# Altium schematic sheet 08_USB_hub.SchDoc: USB 2.0 hub
size A3; Organization: Lime Microsystems; Address1: Surrey Tech Centre; Address2: Guildford GU2 7YG; Address3: Surrey; Address4: United Kingdom; Revision: v1.2; SheetNumber: 8; SheetTotal: 13
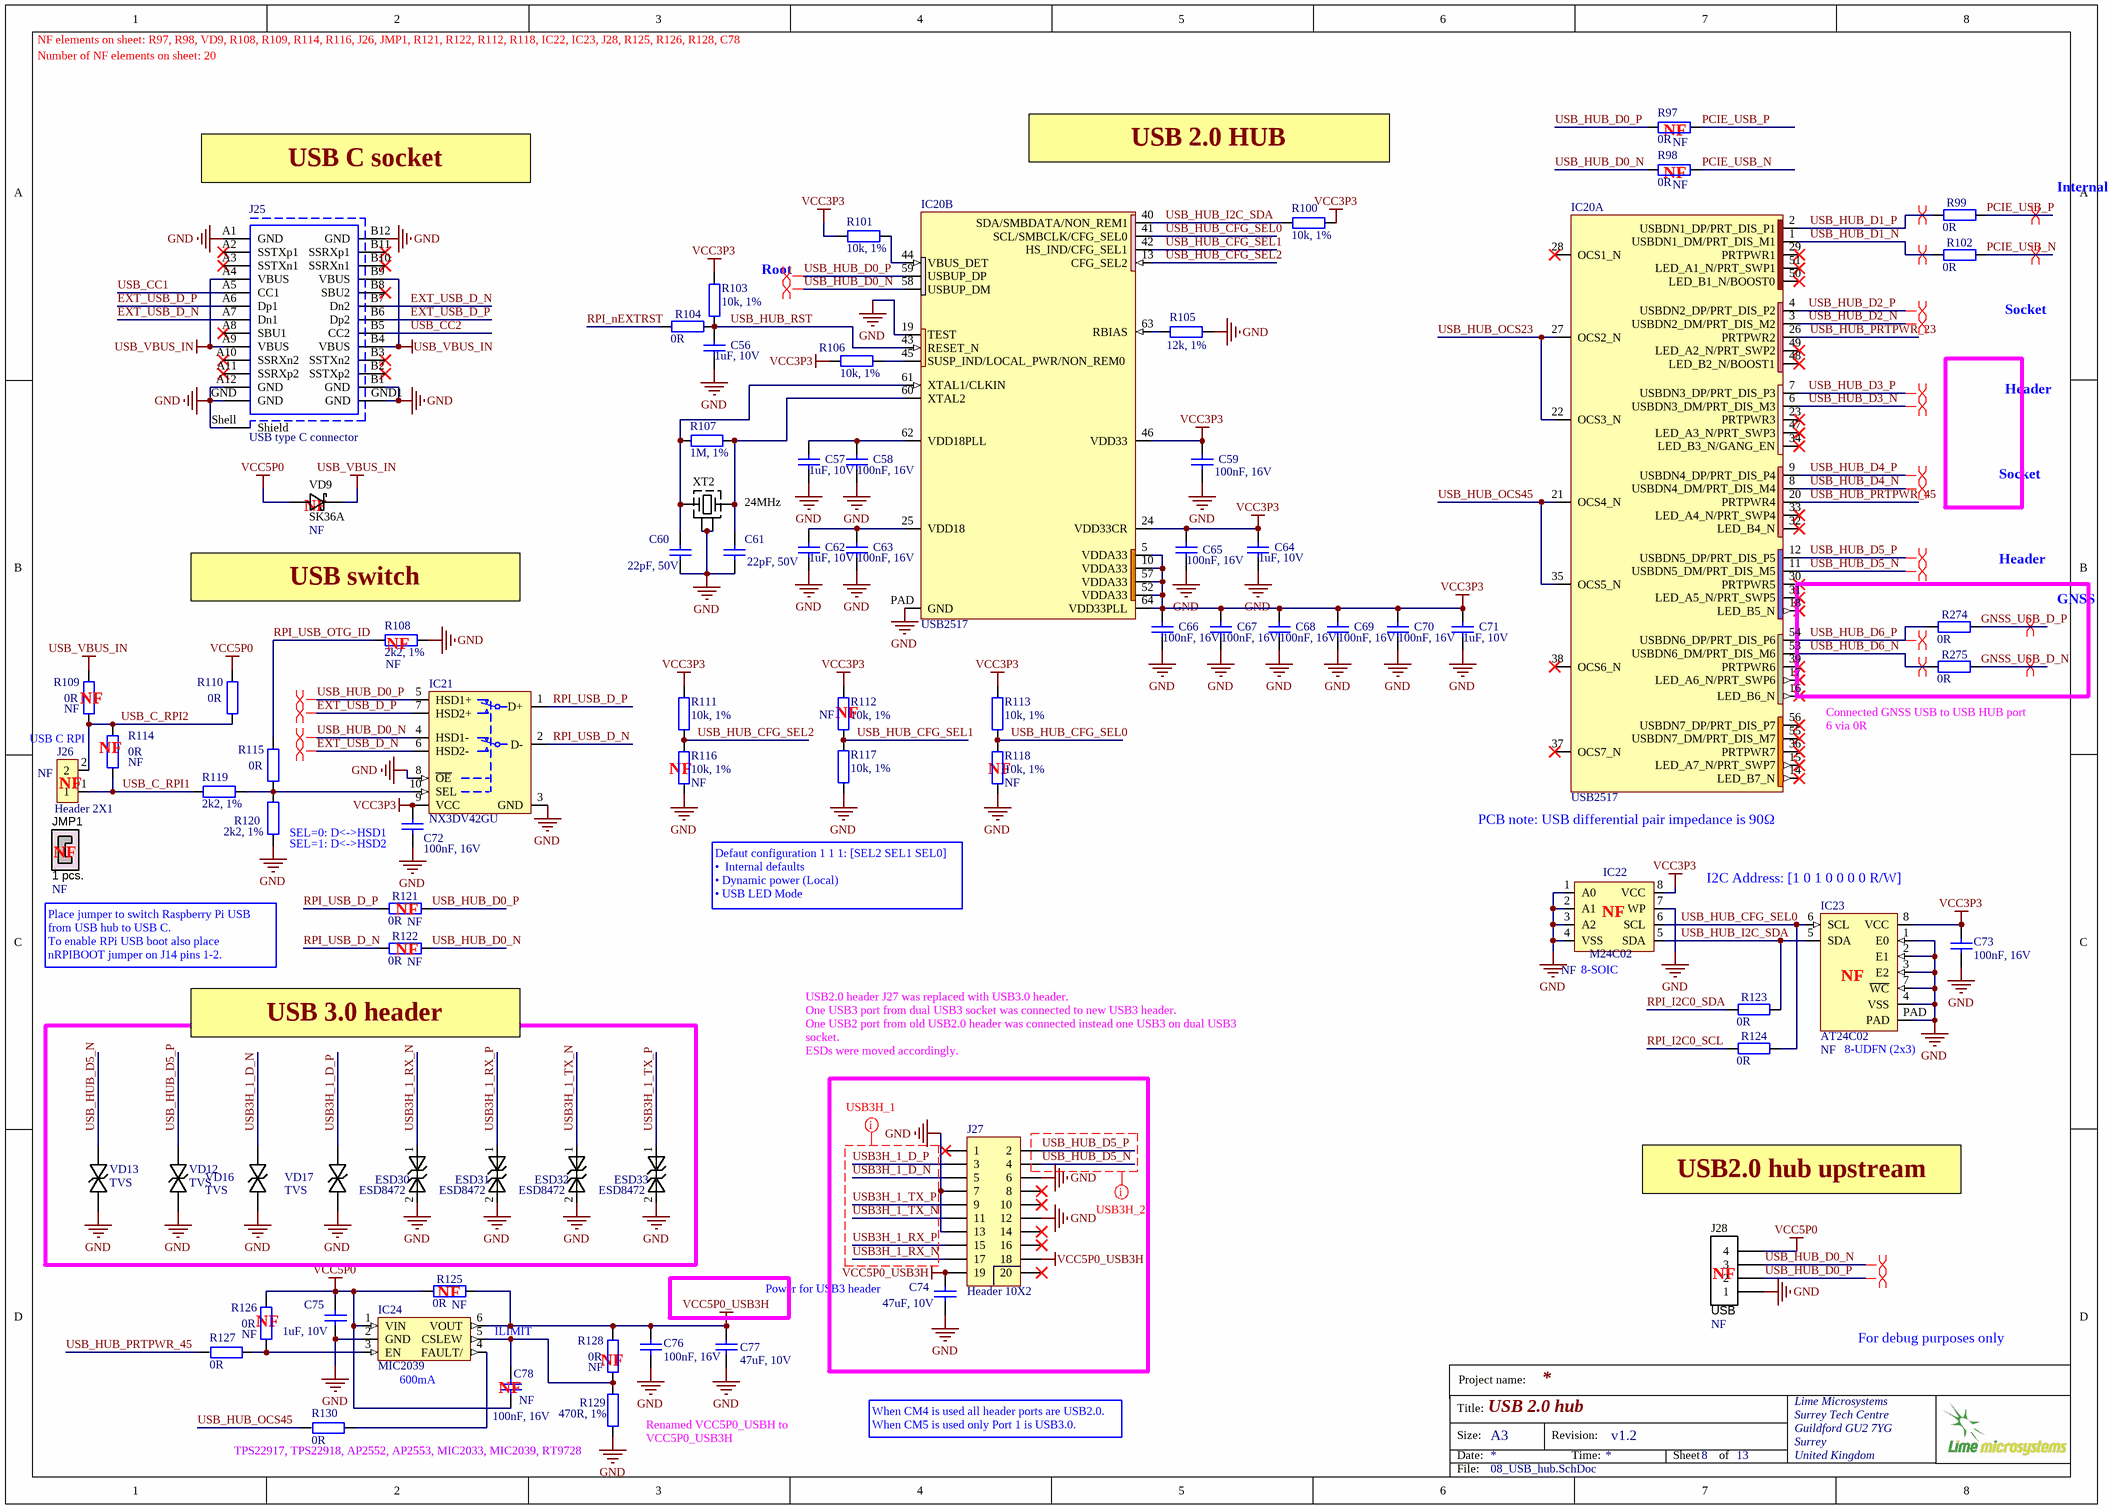
[diagram p0: 08_USB_hub.SchDoc]

## Parts
C56  1uF, 10V  [CAP0402]
C57  1uF, 10V  [CAP0402]
C58  100nF, 16V  [CAP0402]
C59  100nF, 16V  [CAP0402]
C60  22pF, 50V  [CAP0402]
C61  22pF, 50V  [CAP0402]
C62  1uF, 10V  [CAP0402]
C63  100nF, 16V  [CAP0402]
C64  1uF, 10V  [CAP0402]
C65  100nF, 16V  [CAP0402]
C66  100nF, 16V  [CAP0402]
C67  100nF, 16V  [CAP0402]
C68  100nF, 16V  [CAP0402]
C69  100nF, 16V  [CAP0402]
C70  100nF, 16V  [CAP0402]
C71  1uF, 10V  [CAP0402]
C72  100nF, 16V  [CAP0402]
C73  100nF, 16V  [CAP0402]
C74  47uF, 10V  [CAP1206]
C75  1uF, 10V  [CAP0402]
C76  100nF, 16V  [CAP0402]
C77  47uF, 10V  [CAP1206]
C78  100nF, 16V  Assembly Info: NF  [CAP0402]
ESD30  ESD8472  [ESD8472_X3DFN2]
ESD31  ESD8472  [ESD8472_X3DFN2]
ESD32  ESD8472  [ESD8472_X3DFN2]
ESD33  ESD8472  [ESD8472_X3DFN2]
IC20  USB2517  [USB2517-JZX-TR_USB_HUB_QFN64]  (parts A,B of 2)
IC21  NX3DV42GU  [FSUSB42UMX]
IC22  M24C02  Assembly Info: NF  [SOIC127P600-8DL_v2]
IC23  AT24C02  Assembly Info: NF  [M24128-DFMC6TG]
IC24  MIC2039  [SOT23-6]
J25  USB type C connector  [DUAL_USB-C_632723100011]
J26  Header 2X1  Assembly Info: NF  [HDR_1x2]
J27  Header 10X2  [Header10x2_TH_2MM]
J28  USB  Assembly Info: NF  [HEADER4X1_TH]
JMP1  1 pcs.  Assembly Info: NF  (mechanical)
R97  0R  Assembly Info: NF  [RES0402]
R98  0R  Assembly Info: NF  [RES0402]
R99  0R  [RES0402]
R100  10k, 1%  [RES0402]
R101  10k, 1%  [RES0402]
R102  0R  [RES0402]
R103  10k, 1%  [RES0402]
R104  0R  [RES0402]
R105  12k, 1%  [RES0402]
R106  10k, 1%  [RES0402]
R107  1M, 1%  [RES0402]
R108  2k2, 1%  Assembly Info: NF  [RES0402]
R109  0R  Assembly Info: NF  [RES0402]
R110  0R  [RES0402]
R111  10k, 1%  [RES0402]
R112  10k, 1%  Assembly Info: NF  [RES0402]
R113  10k, 1%  [RES0402]
R114  0R  Assembly Info: NF  [RES0402]
R115  0R  [RES0402]
R116  10k, 1%  Assembly Info: NF  [RES0402]
R117  10k, 1%  [RES0402]
R118  10k, 1%  Assembly Info: NF  [RES0402]
R119  2k2, 1%  [RES0402]
R120  2k2, 1%  [RES0402]
R121  0R  Assembly Info: NF  [RES0402]
R122  0R  Assembly Info: NF  [RES0402]
R123  0R  [RES0402]
R124  0R  [RES0402]
R125  0R  Assembly Info: NF  [RES0402]
R126  0R  Assembly Info: NF  [RES0402]
R127  0R  [RES0402]
R128  0R  Assembly Info: NF  [RES0402]
R129  470R, 1%  [RES0402]
R130  0R  [RES0402]
R274  0R  [RES0402]
R275  0R  [RES0402]
VD9  SK36A  Assembly Info: NF  [SK32A-L_DIODE_DO-214AC]
VD12  TVS  [SOD323]
VD13  TVS  [SOD323]
VD16  TVS  [SOD323]
VD17  TVS  [SOD323]
XT2  24MHz  [CRYSTAL_4-LCC]

## Nets
GND: C56.1 C57.1 C58.2 C59.2 C60.1 C61.1 C62.1 C63.2 C64.1 C65.2 C66.2 C67.2 C68.2 C69.2 C70.2 C71.1 C72.2 C73.2 C74.1 C75.2 C76.2 C77.1 ESD30.2 ESD31.2 ESD32.2 ESD33.2 IC20.19(TEST) IC20.PAD(GND) IC21.3(GND) IC21.8(~{OE}) IC22.1(A0) IC22.2(A1) IC22.3(A2) IC22.4(VSS) IC22.7(WP) IC23.1(E0) IC23.2(E1) IC23.3(E2) IC23.4(VSS) IC23.7(~{WC}) IC23.PAD IC24.2(GND) J25.A1(GND) J25.A12(GND) J25.B1(GND) J25.B12(GND) J25.GND J25.GND1(GND) J25.Shell(Shield) J27.6 J27.7 J27.12 J27.13 J28.1 R105.2 R108.2 R116.1 R117.2 R118.1 R120.2 R129.1 VD12.K VD13.K VD16.K VD17.K XT2.2(GND) XT2.4(GND)
USB_VBUS_IN: J25.A4(VBUS) J25.A9(VBUS) J25.B4(VBUS) J25.B9(VBUS) R109.2 VD9.K
VCC3P3: C59.1 C64.2 C65.1 C66.1 C67.1 C68.1 C69.1 C70.1 C71.2 C72.1 C73.1 IC20.5(VDDA33) IC20.10(VDDA33) IC20.24(VDD33CR) IC20.46(VDD33) IC20.52(VDDA33) IC20.57(VDDA33) IC20.64(VDD33PLL) IC21.9(VCC) IC22.8(VCC) IC23.8(VCC) R100.2 R101.1 R103.2 R106.2 R111.2 R112.2 R113.2
VCC5P0: C75.1 C78.2 IC24.1(VIN) J28.4 R110.2 R125.2 R126.2 VD9.A
VCC5P0_USB3H: C74.2 C76.1 C77.2 IC24.6(VOUT) J27.18 J27.19 R125.1 R128.2
EXT_USB_D_N: IC21.6(HSD2-) J25.A7(Dn1) J25.B7(Dn2)
EXT_USB_D_P: IC21.7(HSD2+) J25.A6(Dp1) J25.B6(Dp2)
GNSS_USB_D_N: R275.1
GNSS_USB_D_P: R274.1
PCIE_USB_N: R98.2 R102.1
PCIE_USB_P: R97.2 R99.1
RPI_I2C0_SCL: R124.2
RPI_I2C0_SDA: R123.2
RPI_nEXTRST: R104.2
RPI_USB_D_N: IC21.2(D-) R122.2
RPI_USB_D_P: IC21.1(D+) R121.2
RPI_USB_OTG_ID: R108.1 R115.2
USB3H_1_D_N: J27.5 VD16.A
USB3H_1_D_P: J27.3 VD17.A
USB3H_1_RX_N: ESD30.1 J27.17
USB3H_1_RX_P: ESD31.1 J27.15
USB3H_1_TX_N: ESD32.1 J27.11
USB3H_1_TX_P: ESD33.1 J27.9
USB_C_RPI1: J26.1 R114.1 R119.1
USB_C_RPI2: J26.2 R109.1 R110.1 R114.2
USB_CC1: J25.A5(CC1)
USB_CC2: J25.B5(CC2)
USB_HUB_CFG_SEL0: IC20.41(SCL/SMBCLK/CFG_SEL0) IC22.6(SCL) IC23.6(SCL) R113.1 R118.2 R124.1
USB_HUB_CFG_SEL1: IC20.42(HS_IND/CFG_SEL1) R112.1 R117.1
USB_HUB_CFG_SEL2: IC20.13(CFG_SEL2) R111.1 R116.2
USB_HUB_D0_N: IC20.58(USBUP_DM) IC21.4(HSD1-) J28.3 R98.1 R122.1
USB_HUB_D0_P: IC20.59(USBUP_DP) IC21.5(HSD1+) J28.2 R97.1 R121.1
USB_HUB_D1_N: IC20.1(USBDN1_DM/PRT_DIS_M1) R102.2
USB_HUB_D1_P: IC20.2(USBDN1_DP/PRT_DIS_P1) R99.2
USB_HUB_D2_N: IC20.3(USBDN2_DM/PRT_DIS_M2)
USB_HUB_D2_P: IC20.4(USBDN2_DP/PRT_DIS_P2)
USB_HUB_D3_N: IC20.6(USBDN3_DM/PRT_DIS_M3)
USB_HUB_D3_P: IC20.7(USBDN3_DP/PRT_DIS_P3)
USB_HUB_D4_N: IC20.8(USBDN4_DM/PRT_DIS_M4)
USB_HUB_D4_P: IC20.9(USBDN4_DP/PRT_DIS_P4)
USB_HUB_D5_N: IC20.11(USBDN5_DM/PRT_DIS_M5) J27.4 VD13.A
USB_HUB_D5_P: IC20.12(USBDN5_DP/PRT_DIS_P5) J27.2 VD12.A
USB_HUB_D6_N: IC20.53(USBDN6_DM/PRT_DIS_M6) R275.2
USB_HUB_D6_P: IC20.54(USBDN6_DP/PRT_DIS_P6) R274.2
USB_HUB_I2C_SDA: IC20.40(SDA/SMBDATA/NON_REM1) IC22.5(SDA) IC23.5(SDA) R100.1 R123.1
USB_HUB_OCS23: IC20.22(OCS3_N) IC20.27(OCS2_N)
USB_HUB_OCS45: IC20.21(OCS4_N) IC20.35(OCS5_N) R130.2
USB_HUB_PRTPWR_23: IC20.26(PRTPWR2)
USB_HUB_PRTPWR_45: IC20.20(PRTPWR4) R127.2
USB_HUB_RST: C56.2 IC20.43(RESET_N) R103.1 R104.1
NetC57_2: C57.2 C58.1 IC20.62(VDD18PLL)
NetC60_2: C60.2 IC20.61(XTAL1/CLKIN) R107.1 XT2.1(X)
NetC61_2: C61.2 IC20.60(XTAL2) R107.2 XT2.3(X)
NetC62_2: C62.2 C63.1 IC20.25(VDD18)
NetC78_1: C78.1 IC24.5(CSLEW) R128.1 R129.2
NetIC20_44: IC20.44(VBUS_DET) R101.2
NetIC20_45: IC20.45(SUSP_IND/LOCAL_PWR/NON_REM0) R106.1
NetIC20_63: IC20.63(RBIAS) R105.1
NetIC21_10: IC21.10(SEL) R115.1 R119.2 R120.1
NetIC24_3: IC24.3(EN) R126.1 R127.1
NetIC24_4: IC24.4(FAULT/) R130.1

Not connected (* = marked no-connect by the designer): IC20 14(LED_B7_N)* 15(LED_A7_N/PRT_SWP7)* 16(LED_B6_N)* 17(LED_A6_N/PRT_SWP6)* 18(LED_B5_N)* 23(PRTPWR3)* 28(OCS1_N)* 29(PRTPWR1)* 30(PRTPWR5)* 31(LED_A5_N/PRT_SWP5)* 32(LED_B4_N)* 33(LED_A4_N/PRT_SWP4)* 34(LED_B3_N/GANG_EN)* 36(PRTPWR7)* 37(OCS7_N)* 38(OCS6_N)* 39(PRTPWR6)* 47(LED_A3_N/PRT_SWP3)* 48(LED_B2_N/BOOST1)* 49(LED_A2_N/PRT_SWP2)* 50(LED_B1_N/BOOST0)* 51(LED_A1_N/PRT_SWP1)* 55(USBDN7_DM/PRT_DIS_M7)* 56(USBDN7_DP/PRT_DIS_P7)*; J25 A2(SSTXp1)* A3(SSTXn1)* A8(SBU1)* A10(SSRXn2)* A11(SSRXp2)* B2(SSTXp2)* B3(SSTXn2)* B8(SBU2)* B10(SSRXn1)* B11(SSRXp1)*; J27 1* 8* 10* 14* 16* 20*; JMP1 1 2

## Layout directives
differential pair: EXT_USB_D_N, EXT_USB_D_P, GNSS_USB_D_N, GNSS_USB_D_P, PCIE_USB_N, PCIE_USB_P, USB_HUB_D0_N, USB_HUB_D0_P, USB_HUB_D1_N, USB_HUB_D1_P, USB_HUB_D2_N, USB_HUB_D2_P, USB_HUB_D3_N, USB_HUB_D3_P, USB_HUB_D4_N, USB_HUB_D4_P, USB_HUB_D5_N, USB_HUB_D5_P, USB_HUB_D6_N, USB_HUB_D6_P
net class USB3H_2: USB_HUB_D5_N, USB_HUB_D5_P
net class USB3H_1: USB3H_1_D_N, USB3H_1_D_P, USB3H_1_RX_N, USB3H_1_RX_P, USB3H_1_TX_N, USB3H_1_TX_P

## Notes on the sheet
- NF elements on sheet: R97, R98, VD9, R108, R109, R114, R116, J26, JMP1, R121, R122, R112, R118, IC22, IC23, J28, R125, R126, R128, C78
- Number of NF elements on sheet: 20
- USB C socket
- USB 2.0 HUB
- (near R98) NF
- (near R97) NF
- (near R99) Internal (mPCIe)
- Root
- (near R102) Socket
- Header
- (near VD9) NF
- Socket
- USB switch
- (near R108) NF
- GNSS
- (near R109) NF
- (near R112) NF
- USB C RPI
- (near J26) NF
- (near R114) NF
- (near R116) NF
- (near R118) NF
- Connected GNSS USB to USB HUB port 6 via 0R
- (near JMP1) NF
- (near R120) SEL=0: D<->HSD1
- (near R120) SEL=1: D<->HSD2
- (near IC20) PCB note: USB differential pair impedance is 90Ω
- (near R121) NF
- Defaut configuration 1 1 1: [SEL2 SEL1 SEL0]
  •  Internal defaults
  • Dynamic power (Local)
  • USB LED Mode
- (near IC22) NF
- I2C Address: [1 0 1 0 0 0 0 R/W]
- Place jumper to switch Raspberry Pi USB from USB hub to USB C.
  To enable RPi USB boot also place nRPIBOOT jumper on J14 pins 1-2.
- (near R122) NF
- (near IC22) 8-SOIC
- (near IC23) NF
- (near R122) USB 3.0 header
- (near IC23) 8-UDFN (2x3)
- USB2.0 header J27 was replaced with USB3.0 header.
  One USB3 port from dual USB3 socket was connected to new USB3 header.
  One USB2 port from old USB2.0 header was connected instead one USB3 on dual USB3 socket.
  ESDs were moved accordingly.
- USB2.0 hub upstream
- (near R126) NF
- (near R125) NF
- Power for USB3 header
- (near J28) NF
- (near IC24) 600mA
- (near C78) NF
- (near IC24) ILIMIT
- (near R128) NF
- (near J28) For debug purposes only
- TPS22917, TPS22918, AP2552, AP2553, MIC2033, MIC2039, RT9728
- (near R129) Renamed VCC5P0_USBH to VCC5P0_USB3H
- When CM4 is used all header ports are USB2.0.
  When CM5 is used only Port 1 is USB3.0.
- Project name:
- Title:
- Size:
- Date:
- A3
- Revision:
- Time:
- Sheet
- of
- File:

## Library data of the parts
C56 C57 C62 C64 C71 = Cap_0402: CAP CER 1UF 10V X5R 0402; Manufacturer: Yageo; Part Description: 1µF 10V Ceramic Capacitor X5R 0402 (1005 Metric) 0.039" L x 0.020" W (1.00mm x 0.50mm); Manufacturer Part Number 1: CC0402MRX5R6BB105; Notification: Current market demand for these product types have resulted in fluctuating and extending lead times. Lead times may differ.; Tolerance: ±20%; Value: 1uF, 10V; Supplier 1: Digi-Key; Supplier Part Number 1: 311-1732-1-ND; RoHS: RoHS Compliant; Applications: General Purpose; Category: Capacitors; ComponentLink1Description: http://www.yageo.com/documents/recent/UPY-GPHC_X5R_4V-to-50V_25.pdf; ComponentLink1URL: http://www.yageo.com/documents/recent/UPY-GPHC_X5R_4V-to-50V_25.pdf; Failure Rate: -; Features: -; Height - Seated (Max): -; Lead Spacing: -; Lead Style: -; Mounting Type: Surface Mount, MLCC; Operating Temperature: -55°C ~ 85°C; Package / Case: 0402 (1005 Metric); Packaging: Cut Tape (CT); Part Status: Active; Pricing 1: 1=0.22, 10=0.156, 100=0.0732, 500=0.0513, 1000=0.04248, 2500=0.03953, 5000=0.03617 (USD); Ratings: -; Size / Dimension: 0.039" L x 0.020" W (1.00mm x 0.50mm); Stock 1: 69600; Temperature Coefficient: X5R; Thickness (Max): 0.022" (0.55mm); Voltage - Rated: 10V
C58 C59 C63 C65-C70 C72 = Cap_0402: Manufacturer: Murata Electronics; Manufacturer Part Number: GRM155R71C104KA88D; Part Description: 0.10µF ±10% 16V Ceramic Capacitor X7R 0402 (1005 Metric); Tolerance: 10 %; Type: General Purpose MLCC; Capacitance: 0.1 uF; Case Length: 1 mm; Dielectric: X7R; Case Height: 0.5 mm; Temperature Coefficient / Code: +/- 15 %; Value: 100nF, 16V; Supplier 1: Mouser; Supplier Part Number 1: 81-GRM155R71C104KA88; Case Code - in: 0402; RoHS: RoHS Compliant; Operating Temperature Range: - 55 C to + 125 C; Series: GRM; Termination Style: SMD/SMT; Package / Case: 0402 (1005 metric); Voltage Rating DC: 16 V; Maximum Operating Temperature: + 125 C; Case Code - mm: 1005; Minimum Operating Temperature: - 55 C; Product Category: Low & Medium Capacitance SMD Ceramic Chip Capacitors; Packaging: Reel; Product: General Type MLCCs; Category: Multilayer Ceramic Capacitors MLCC - SMD/SMT; Brand: Murata Electronics; Case Width: 0.5 mm; RoHS - Mouser: Y; Standard Pack Qty: 10000; Minimum Order Quantity: 1; Reeling: True; Manufacturer Part Number 1: GRM155R71C104KA88D
C60 C61 = Cap_0402: Manufacturer: Yageo; Manufacturer Part Number 1: CC0402JRNPO9BN220; Part Description: 22pF ±5% 50V C0G, NP0 Ceramic Capacitor -55°C ~ 125°C Surface Mount, MLCC 0402 (1005 Metric) 0.039" L x 0.020" W (1.00mm x 0.50mm); Tolerance: ±5%; Temperature Coefficient: C0G, NP0; Value: 22pF, 50V; Supplier 1: Digi-Key; Supplier Part Number 1: 311-1018-2-ND; Category: Capacitors; Voltage - Rated: 50V; Packaging: Tape & Reel (TR); RoHS: RoHS Compliant; Capacitance: 22pF; Operating Temperature: -55°C ~ 125°C; Mounting Type: Surface Mount, MLCC; Height - Seated (Max): -; Size / Dimension: 0.039" L x 0.020" W (1.00mm x 0.50mm); Ratings: -; Applications: General Purpose; Thickness (Max): 0.022" (0.55mm); Lead Spacing: -; Lead Style: -; Features: -; Package / Case: 0402 (1005 Metric)
C73 = Cap_0603: Manufacturer Part Number 1: GRM155R71C104KA88D; Part Description: 0.10µF ±10% 16V Ceramic Capacitor X7R 0402 (1005 Metric); Brand: Murata Electronics; Tolerance: 10 %; Type: General Purpose MLCC; Capacitance: 0.1 uF; Temperature Coefficient / Code: +/- 15 %; Case Height: 0.5 mm; Case Length: 1 mm; Dielectric: X7R; Supplier 1: Mouser; Supplier Part Number 1: 81-GRM155R71C104KA88; Case Code - in: 0402; Manufacturer: Murata Electronics; Category: Multilayer Ceramic Capacitors MLCC - SMD/SMT; Voltage Rating DC: 16 V; Value: 100nF, 16V; Manufacturer Part Number: GRM155R71C104KA88D; Case Code - mm: 1005; Case Width: 0.5 mm; Maximum Operating Temperature: + 125 C; Minimum Operating Temperature: - 55 C; Minimum Order Quantity: 1; Operating Temperature Range: - 55 C to + 125 C; Package / Case: 0402 (1005 metric); Packaging: Reel; Product: General Type MLCCs; Product Category: Low & Medium Capacitance SMD Ceramic Chip Capacitors; Reeling: True; RoHS - Mouser: Y; RoHS: RoHS Compliant; Series: GRM; Standard Pack Qty: 10000; Termination Style: SMD/SMT
C74 C77 = Cap_1206: Manufacturer: TDK Corporation; Manufacturer Part Number 1: C3216X6S1A476M160AC; Part Description: 47µF ±20% 10V Ceramic Capacitor X6S 1206 (3216 Metric); Notification: Current market demand for these product types have resulted in fluctuating and extending lead times. Lead times may differ.; Tolerance: ±20%; Temperature Coefficient: X6S; Value: 47uF, 10V; RoHS: RoHS Compliant; Packaging: Cut Tape (CT); Operating Temperature: -55°C ~ 105°C; Voltage - Rated: 10V; Height - Seated (Max): -; Ratings: -; Applications: General Purpose; Features: Low ESL; Size / Dimension: 0.126" L x 0.063" W (3.20mm x 1.60mm); Supplier 1: Digi-Key; Lead Spacing: -; Supplier Part Number 1: 445-6010-1-ND; Thickness (Max): 0.071" (1.80mm); Failure Rate: -; Category: Capacitors; Lead Style: -; Part Status: Active; Mounting Type: Surface Mount, MLCC; Package / Case: 1206 (3216 Metric)
C75 = Cap_0402: Manufacturer Part Number 1: CC0402MRX5R6BB105; Manufacturer: Yageo; Part Description: 1µF 10V Ceramic Capacitor X5R 0402 (1005 Metric) 0.039" L x 0.020" W (1.00mm x 0.50mm); Voltage Rating: 10; Capacitance Tolerance: ± 10%; Product Range: TDK - C Series; Ceramic Capacitor Case: 0402 [1005 Metric]; Capacitance: 1; Dielectric Characteristic: X6; Value: 1uF, 10V; Supplier 1: Digi-Key; Supplier Part Number 1: 311-1732-1-ND; MSL: -; RoHS: YES
C76 C78 = Cap_0402: Manufacturer: Murata Electronics; Manufacturer Part Number 1: GRM155R71C104KA88D; Part Description: 0.10µF ±10% 16V Ceramic Capacitor X7R 0402 (1005 Metric); Tolerance: 10 %; Type: General Purpose MLCC; Capacitance: 0.1 uF; Case Length: 1 mm; Dielectric: X7R; Case Height: 0.5 mm; Temperature Coefficient / Code: +/- 15 %; Value: 100nF, 16V; Supplier 1: Mouser; Supplier Part Number 1: 81-GRM155R71C104KA88; Case Code - in: 0402; RoHS: RoHS Compliant; Operating Temperature Range: - 55 C to + 125 C; Series: GRM; Termination Style: SMD/SMT; Package / Case: 0402 (1005 metric); Voltage Rating DC: 16 V; Maximum Operating Temperature: + 125 C; Case Code - mm: 1005; Minimum Operating Temperature: - 55 C; Product Category: Low & Medium Capacitance SMD Ceramic Chip Capacitors; Packaging: Reel; Product: General Type MLCCs; Category: Multilayer Ceramic Capacitors MLCC - SMD/SMT; Brand: Murata Electronics; Case Width: 0.5 mm; RoHS - Mouser: Y; Standard Pack Qty: 10000; Minimum Order Quantity: 1; Reeling: True; Manufacturer Part Number: GRM155R71C104KA88D
ESD30-ESD33 = ESD8472: Manufacturer: ON Semiconductor; Manufacturer Part Number 1: ESD8472MUT5G; Part Description: TVS DIODE 5.3VWM 14VC X3DFN2; Voltage - Reverse Standoff (Typ): 5.3V (Max); Voltage - Breakdown (Min): 7V; Voltage - Clamping (Max) @ Ipp: 14V; Current - Peak Pulse (10/1000µs): 3A (8/20µs); Power Line Protection: No; Capacitance @ Frequency: 0.2pF @ 1MHz; Supplier 1: Digi-Key; RoHS: RoHS Compliant; Category: Circuit Protection; Stock 1: 2295; Pricing 1: 1=0.39, 10=0.315, 100=0.2142, 500=0.16068, 1000=0.12051 (USD); Packaging: Cut Tape (CT); Part Status: Active; Type: Zener; Power - Peak Pulse: -; Applications: Automotive, RF Antenna; Operating Temperature: -55°C ~ 150°C (TJ); Mounting Type: Surface Mount; Package / Case: 2-XFDFN; Supplier Device Package: 2-X3DFN (0.62x0.32); ComponentLink1URL: http://www.onsemi.com/pub/Collateral/ESD8472-D.PDF; ComponentLink1Description: http://www.onsemi.com/pub/Collateral/ESD8472-D.PDF; Supplier Part Number 1: ESD8472MUT5GOSCT-ND
IC20 = USB2517-JZX-TR_USB_HUB: Part Description: USB Hub Controller USB 2.0 USB Interface 64-QFN (9x9); Manufacturer: Microchip; Interface: USB; Operating Supply Current: 130mA; Supplier 1: Digi-Key; Supplier Part Number 1: USB2517-JZX-CT-ND; Manufacturer Part Number 1: USB2517-JZX-TR; Stock 1: 26622; Pricing 1: 1=5,72000, 25=5,55000 (USD); RoHS: Yes; Min Operating Temperature: 0°C; Max Operating Temperature: 70°C; Package Quantity: 3000; Packaging: Tape and Reel; Lead Free: Lead Free; RoHS Compliant: Yes; ComponentLink1URL: https://datasheet.ciiva.com/29644/2517-29644802.pdf?src-supplier=Digi-Key; ComponentLink1Description: https://datasheet.ciiva.com/29644/2517-29644802.pdf?src-supplier=Digi-Key
IC21 = FSUSB42UMX: Part Description: USB Switch IC 1 Channel 10-UMLP (1.8x1.4); Manufacturer: NXP Semiconductors; Manufacturer Part Number 1: NX3DV42GU,115; ComponentLink1URL: https://www.fairchildsemi.com/datasheets/FS/FSUSB42.pdf; ComponentLink1Description: https://www.fairchildsemi.com/datasheets/FS/FSUSB42.pdf; Supplier 1: Digikey; Supplier Part Number 1: 568-12388-1-ND; Stock 1: 3109; Pricing 1: 1=0,89, 10=0,781, 25=0,7336, 100=0,5987, 250=0,55612, 500=0,47328, 1000=0,37863 (USD); RoHS: Yes; ComponentLink2URL: http://www.mouser.com/ds/2/302/NX3DV42-1127466.pdf?src-supplier=Mouser; ComponentLink2Description: http://www.mouser.com/ds/2/302/NX3DV42-1127466.pdf?src-supplier=Mouser; ComponentLink3URL: http://www.nxp.com/documents/data_sheet/NX3DV42.pdf?src-supplier=Avnet; ComponentLink3Description: http://www.nxp.com/documents/data_sheet/NX3DV42.pdf?src-supplier=Avnet; ComponentLink4URL: http://www.nxp.com/documents/data_sheet/NX3DV42.pdf?src-supplier=Digikey; ComponentLink4Description: http://www.nxp.com/documents/data_sheet/NX3DV42.pdf?src-supplier=Digikey; ComponentLink5URL: https://www.nxp.com/docs/en/data-sheet/NX3DV42.pdf?src-supplier=Digikey; ComponentLink5Description: https://www.nxp.com/docs/en/data-sheet/NX3DV42.pdf?src-supplier=Digikey
IC22 = 24FC64F: Part Description: IC EEPROM 2KBIT I2C 400KHZ 8SOIC; Manufacturer: STMicroelectronics; Manufacturer Part Number 1: M24C02-RMN6TP; Max Supply Voltage: 5.5V; Min Supply Voltage: 1.8V; Interface: I2C,Serial,2-Wire; Access Time: 900ns; Frequency: 400kHz; Nominal Supply Current: 800uA; Density: 2Kb; Memory Type: EEPROM; Organization: 256X8; Write Protection: YES; Write Cycle Time-Max (tWC): 5ms; ComponentLink1URL: http://www.onsemi.com/pub/Collateral/CAT24C128-D.PDF; ComponentLink1Description: http://www.onsemi.com/pub/Collateral/CAT24C128-D.PDF; Supplier 1: Digi-Key; Supplier Part Number 1: 497-8633-1-ND; Stock 1: 84403; Pricing 1: 1=0,17000, 10=0,16400, 25=0,15200, 50=0,15140, 100=0,13440, 250=0,13272, 500=0,13070, 1000=0,12721 (USD); RoHS: Yes; Mount: Surface Mount; Case/Package: SOIC; Number of Pins: 8; Contact Plating: Gold; Min Operating Temperature: -40°C; Max Operating Temperature: 85°C; Packaging: Tape and Reel; Package Quantity: 1; Memory Size: 2Kb; Max Frequency: 400kHz; Series: -; Programming Voltage: 5.5V; Access Time-Max: 900ns; Supply Current: 800uA; Supply Voltage-Nom: 5.5V; Length: 4.9mm; Width: 3.9mm; Height: 1.25mm; Radiation Hardening: No; Reach SVHC Compliant: Yes; Lead Free: Lead Free; RoHS Compliant: Yes; ComponentLink2URL: https://datasheet.ciiva.com/41455/001186000-da-01-en-ic-eeprom-2kbit-m24c02-rmn6tp-soic-8-stm-41455162.pdf?src-supplier=Conrad; ComponentLink2Description: https://datasheet.ciiva.com/41455/001186000-da-01-en-ic-eeprom-2kbit-m24c02-rmn6tp-soic-8-stm-41455162.pdf?src-supplier=Conrad
IC23 = M24128-DFMC6TG: Part Description: IC EEPROM 2KBIT I2C 1MHZ 8UDFN; Manufacturer: Microchip; Manufacturer Part Number 1: AT24C02C-MAHM-E; ComponentLink1URL: http://www.st.com/content/ccc/resource/technical/document/datasheet/59/05/c9/5b/7b/41/48/b6/CD00259167.pdf/files/CD00259167.pdf/jcr:content/translations/en.CD00259167.pdf; ComponentLink1Description: http://www.st.com/content/ccc/resource/technical/document/datasheet/59/05/c9/5b/7b/41/48/b6/CD00259167.pdf/files/CD00259167.pdf/jcr:content/translations/en.CD00259167.pdf; Supplier 1: Digi-Key; Supplier Part Number 1: AT24C02C-MAHM-ECT-ND; Stock 1: 14438; Pricing 1: 1=0,28000 (USD); RoHS: No; RoHS Compliant: No; ComponentLink2URL: http://www.microchip.com/mymicrochip/filehandler.aspx?ddocname=en590438&src-supplier=Digi-Key; ComponentLink2Description: http://www.microchip.com/mymicrochip/filehandler.aspx?ddocname=en590438&src-supplier=Digi-Key
IC24 = MIC2033_power_switch: Part Description: Power Switch/Driver 1:1 P-Channel 2.5A SOT-23-6; Manufacturer: Microchip; Manufacturer Part Number 1: MIC2039EYM6-TR; Number of Outputs: 1; Interface: On/Off; Max Output Current: 2.5A; Fault Protection: Over Temperature; Output Configuration: High Side; ComponentLink1URL: http://www.mouser.com/ds/2/268/mic2033-b-1076865.pdf?src-supplier=Mouser; ComponentLink1Description: http://www.mouser.com/ds/2/268/mic2033-b-1076865.pdf?src-supplier=Mouser; ComponentLink2URL: http://components.arrow.com/part/dataview/56727820S413982N1374?src-supplier=Arrow+Electronics; ComponentLink2Description: http://components.arrow.com/part/dataview/56727820S413982N1374?src-supplier=Arrow+Electronics; ComponentLink3URL: http://www.microchip.com/mymicrochip/filehandler.aspx?ddocname=en579457&src-supplier=Digi-Key; ComponentLink3Description: http://www.microchip.com/mymicrochip/filehandler.aspx?ddocname=en579457&src-supplier=Digi-Key; Supplier 1: Digi-Key; Supplier Part Number 1: 576-4193-1-ND; Stock 1: 37195; Pricing 1: 1=0,98000, 25=0,80560, 100=0,75000 (USD); RoHS: No; Case/Package: SOT-23-6; Min Operating Temperature: -40°C; Max Operating Temperature: 125°C; Package Quantity: 3000; Packaging: Tape and Reel; Series: -; ComponentLink4URL: https://datasheet.ciiva.com/6607/mic2039-6607725.pdf?src-supplier=Digi-Key; ComponentLink4Description: https://datasheet.ciiva.com/6607/mic2039-6607725.pdf?src-supplier=Digi-Key
J25 = DUAL_USB-C_632723100011: Manufacturer: Wurth Electronics; Part Description: USB - C (Type - C) USB 3.1 (USB 3.1 Gen 2, Superspeed+) Receptacle Connector 24 Position Surface Mount, Right Angle; Through Hole; Number of Contacts: 24; Gender: Receptacle; ComponentLink1URL: http://www.alliedelec.com/m/d/e03b7b5d71e2d3e369c52d5c8eaca2b6.pdf?src-supplier=Allied+Electronics; ComponentLink1Description: http://www.alliedelec.com/m/d/e03b7b5d71e2d3e369c52d5c8eaca2b6.pdf?src-supplier=Allied+Electronics; ComponentLink2URL: http://www.jae.com/z-en/pdf_download_exec.cfm?param=SJ115995.pdf&src-supplier=Digi-Key; ComponentLink2Description: http://www.jae.com/z-en/pdf_download_exec.cfm?param=SJ115995.pdf&src-supplier=Digi-Key; Supplier 1: Digi-Key; Supplier Part Number 1: 732-9617-1-ND; Manufacturer Part Number 1: 632723100011; Stock 1: 1127; Pricing 1: 1=4,10000, 10=3,80000, 50=3,20000, 100=2,95000 (USD); RoHS: Yes; Mount: Surface Mount,Through Hole; Packaging: Tape and Reel; Connector Type: USB; ComponentLink3URL: https://www.mouser.com/ds/2/445/632723x00011-782157.pdf?src-supplier=Mouser; ComponentLink3Description: https://www.mouser.com/ds/2/445/632723x00011-782157.pdf?src-supplier=Mouser; ComponentLink4URL: https://katalog.we-online.de/em/datasheet/632723x00011.pdf?src-supplier=Digi-Key; ComponentLink4Description: https://katalog.we-online.de/em/datasheet/632723x00011.pdf?src-supplier=Digi-Key
J26 = Jumper: Manufacturer Part Number 1: 961102-6404-AR; Part Description: 2 Positions Header, Unshrouded Connector 0.100" (2.54mm) Through Hole Gold; Manufacturer: 3M; Connector Type: Header, Unshrouded; Supplier 1: Digi-Key; Supplier Part Number 1: 3M9447-ND; Contact Type: Male Pin; Color: Black; Mounting Type: Through Hole; Category: Connectors, Interconnects; Contact Finish: Gold
J27 = Header 10X2: Header, 10-Pin, Dual row; Part Description: Connector Header Through Hole 20 position 0.079" (2.00mm). 19 pins loaded (pin 20 void); Manufacturer: Molex; Manufacturer Part Number 1: 87831-5920; Supplier 1: Mouser; Supplier Part Number 1: 538-87831-5920; Stock 1: 4168; Pricing 1: 1=2,22, 10=1,98, 50=1,98, 100=1,74, 1000=1,49, 10000=1,35 (USD); RoHS: Yes
J28 = Header4P: Header, 4-pin; Part Description: 4 Positions Header Connector 0.100" (2.54mm) Through Hole Gold; Manufacturer: Wurth Electronics Inc.; Manufacturer Part Number 1: 61300411121; Pitch - Mating: 0.100" (2.54mm); Number of Positions: 4; Number of Positions Loaded: All; Style: Board to Board or Cable; Shrouding: Unshrouded; Contact Length - Mating: 0.236" (6.00mm); Contact Length - Post: 0.118" (3.00mm); Overall Contact Length: 0.454" (11.54mm); Material Flammability Rating: UL94 V-0; Current Rating: 3A; Voltage Rating: 250V; Supplier 1: Digi-Key; Supplier Part Number 1: 732-5317-ND; RoHS: RoHS Compliant; Category: Connectors, Interconnects; Stock 1: 25204; Pricing 1: 1=0.18, 10=0.153, 25=0.1272, 50=0.106, 100=0.096, 1000=0.088 (USD); Packaging: Bulk; Part Status: Active; Connector Type: Header; Contact Type: Male Pin; Number of Rows: 1; Row Spacing - Mating: -; Mounting Type: Through Hole; Termination: Solder; Fastening Type: Push-Pull; Insulation Height: 0.100" (2.54mm); Contact Shape: Square; Contact Finish - Mating: Gold; Contact Finish Thickness - Mating: -; Contact Finish - Post: -; Contact Material: Copper Alloy; Insulation Material: Polybutylene Terephthalate (PBT); Features: -; Operating Temperature: -40°C ~ 125°C; Ingress Protection: -; Insulation Color: Black; Mated Stacking Heights: -; Contact Finish Thickness - Post: -; Applications: -; ComponentLink1URL: http://katalog.we-online.de/em/datasheet/6130xx11121.pdf; ComponentLink1Description: http://katalog.we-online.de/em/datasheet/6130xx11121.pdf
JMP1 = JUMP_2P_CONN_HEADER: Shorting Jumper, 2-position, 1.27mm pitch; Part Description: 2 (1 x 2) Position Shunt Connector Black Closed Top 0.100" (2.54mm) Gold; Manufacturer: Sullins; Manufacturer Part Number 1: SPC02SYAN; Number of Positions: 2; Pitch: 0.1inch; Supplier 1: Digi-Key; Supplier Part Number 1: S9001-ND; Stock 1: 570741; Pricing 1: 1=0.1, 10=0.059, 25=0.044, 50=0.0378, 100=0.0365, 250=0.03152, 500=0.03024, 1000=0.02646, 2500=0.02394 (USD); Colour: Black; Contact Plating: Gold; Package Quantity: 1000; Packaging: Bulk; Height: 0.256inch; Lead Free: Lead Free; ComponentLink1URL: http://www.sullinscorp.com/images/SPC02SYAN-0-3293.pdf; ComponentLink1Description: http://www.sullinscorp.com/images/SPC02SYAN-0-3293.pdf; ComponentLink2URL: https://drawings-pdf.s3.amazonaws.com/11134.pdf; ComponentLink2Description: https://drawings-pdf.s3.amazonaws.com/11134.pdf
R97-R99 R102 R104 R109 R110 R114 R115 R121-R128 R130 R274 R275 = Res_0402: Manufacturer Part Number 1: RC0402JR-070RL; Manufacturer: Yageo; Part Description: RES SMD 0.0OHM JUMPER 1/16W 0402; Resistance (Ohms): 0.0; Tolerance: Jumper; Power (Watts): 0.063W, 1/16W; Value: 0R; Supplier 1: Digi-Key; Supplier Part Number 1: 311-0.0JRTR-ND; Category: Resistors; Temperature Coefficient: -; Features: Moisture Resistant; Supplier Device Package: 0402; Height: 0.016" (0.40mm); Package / Case: 0402 (1005 Metric); Operating Temperature: -55°C ~ 155°C; Size / Dimension: 0.039" L x 0.020" W (1.00mm x 0.50mm); Composition: Thick Film; Packaging: Tape & Reel (TR); Number of Terminations: 2; RoHS: RoHS Compliant
R100 R101 R103 R106 R111-R113 R116-R118 = Res_0402: Manufacturer: Yageo; Manufacturer Part Number 1: RC0402FR-0710KL; Part Description: RES SMD 10K OHM 1% 1/16W 0402; Temperature Coefficient: ±100ppm/°C; Power (Watts): 0.063W, 1/16W; Value: 10k, 1%; Supplier 1: Digi-Key; Supplier Part Number 1: 311-10.0KLRTR-ND; Resistance (Ohms): 10k; Packaging: Tape & Reel (TR); RoHS: RoHS Compliant; Package / Case: 0402 (1005 Metric); Tolerance: ±1%; Operating Temperature: -55°C ~ 155°C; Size / Dimension: 0.039" L x 0.020" W (1.00mm x 0.50mm); Number of Terminations: 2; Category: Resistors; Height: 0.016" (0.40mm); Supplier Device Package: 0402; Features: Moisture Resistant; Composition: Thick Film
R105 = Res_0402: Manufacturer: Samsung Electro-Mechanics; Manufacturer Part Number 1: RC1005F123CS; Part Description: 12 kOhms ±1% 0.063W, 1/16W Chip Resistor 0402 (1005 Metric) Moisture Resistant Thick Film; Power (Watts): 0.063W, 1/16W; Temperature Coefficient: ±100ppm/°C; Value: 12k, 1%; Operating Temperature: -55°C ~ 155°C; Height - Seated (Max): 0.016" (0.40mm); Supplier 1: Digi-Key; Packaging: Cut Tape (CT); Composition: Thick Film; Tolerance: ±1%; Category: Resistors; Part Status: Active; Failure Rate: -; Supplier Device Package: 0402; Features: Moisture Resistant; Supplier Part Number 1: 1276-4122-1-ND; RoHS: RoHS Compliant; Package / Case: 0402 (1005 Metric); Size / Dimension: 0.039" L x 0.020" W (1.00mm x 0.50mm)
R107 = Res_0402: Manufacturer Part Number 1: RC0402FR-071ML; Manufacturer: Yageo; Part Description: 1 MOhms ±1% 0.063W, 1/16W Chip Resistor 0402 (1005 Metric) Moisture Resistant Thick Film; Power (Watts): 0.063W, 1/16W; Temperature Coefficient: ±100ppm/°C; Value: 1M, 1%; Package / Case: 0402 (1005 Metric); Failure Rate: -; Supplier Device Package: 0402; Tolerance: ±1%; Composition: Thick Film; Category: Resistors; Part Status: Active; Height - Seated (Max): 0.016" (0.40mm); Size / Dimension: 0.039" L x 0.020" W (1.00mm x 0.50mm); Supplier 1: Digi-Key; Operating Temperature: -55°C ~ 155°C; Supplier Part Number 1: 311-1.00MLRCT-ND; RoHS: RoHS Compliant; Features: Moisture Resistant; Packaging: Cut Tape (CT)
R108 R119 R120 = Res_0402: Manufacturer: Stackpole Electronics Inc; Manufacturer Part Number 1: RMCF0402FT2K20; Part Description: RES SMD 2.2K OHM 1% 1/16W 0402; Resistance (Ohms): 2.2k; Temperature Coefficient: ±100ppm/°C; Power (Watts): 0.063W, 1/16W; Value: 2k2, 1%; Supplier 1: Digi-Key; Supplier Part Number 1: RMCF0402FT2K20CT-ND; Supplier Device Package: 0402; Package / Case: 0402 (1005 Metric); Size / Dimension: 0.039" L x 0.020" W (1.00mm x 0.50mm); Operating Temperature: -55°C ~ 155°C; Composition: Thick Film; Category: Resistors; Features: -; Height: 0.016" (0.40mm); RoHS: RoHS Compliant; Number of Terminations: 2; Packaging: Cut Tape (CT); Tolerance: ±1%
R129 = Res_0402: Manufacturer 1: Yageo; Manufacturer Part Number 1: RC0402FR-07470RL; Part Description: 470 Ohms ±1% 0.063W, 1/16W Chip Resistor 0402 (1005 Metric) Moisture Resistant Thick Film; Power Rating: 62.5mW; Temperature Coefficient: 100ppm/°C; Voltage Rating: 50V; Max Power Dissipation: 63mW; Value: 470R, 1%; Supplier 1: Digi-Key; Supplier Part Number 1: 311-470LRCT-ND; Stock 1: 1652476; Pricing 1: 1=0,10000, 10=0,01600, 100=0,00660, 1000=0,00299, 2500=0,00259, 5000=0,00214 (USD); RoHS: Yes; Case/Package: 0402; Case Code (Metric): 1005; Case Code (Imperial): 0402; Size Code: 0402; Min Operating Temperature: -55°C; Max Operating Temperature: 155°C; Packaging: Tape and Reel; Tolerance: 1%; Resistance: 470R; Number of Terminations: 2; Features: Moisture Resistant; Package Quantity: 1; Resistor Type: Thick Film; Termination: SMD/SMT; Series: RC; Resistance Tolerance: 1%; Construction: Rectangular; Length: 1mm; Width: 0.02inch; Height: 0.016inch; Depth: 0.5mm; Lead Free: Lead Free; REACH SVHC: Unknown; Military Standard: Not; RoHS Compliant: Yes; Manufacturer: Yageo
VD9 = DIODE_SCHOTTKY_SOD-523F: Diode Schottky SMD SOD-523F; Manufacturer Part Number 1: SK36A-LTP; Manufacturer: Micro Commercial Co; Part Description: DIODE SCHOTTKY 60V 3A DO214AC; Current - Reverse Leakage @ Vr: 500µA @ 60V; Speed: Fast Recovery =< 500ns, > 200mA (Io); Voltage - DC Reverse (Vr) (Max): 60V; Capacitance @ Vr, F: 250pF @ 4V, 1MHz; Voltage - Forward (Vf) (Max) @ If: 750mV @ 3A; Current - Average Rectified (Io): 3A; Supplier 1: Digi-Key; Supplier Part Number 1: SK36A-LTPMSCT-ND; Package / Case: DO-214AC, SMA; Reverse Recovery Time (trr): -; Diode Type: Schottky; Category: Discrete Semiconductor Products; Mounting Type: Surface Mount; RoHS: RoHS Compliant; Packaging: Cut Tape (CT); Operating Temperature - Junction: -50°C ~ 125°C; Supplier Device Package: DO-214AC (SMA)
VD12 VD13 VD16 VD17 = DIODE_TVS: Manufacturer 1: Sangdest Microelectronics; Manufacturer Part Number: SD03LCC; Part Description: 19V Clamp 20A (8/20µs) Ipp Tvs Diode Surface Mount SOD-323; ComponentLink1URL: https://datasheet.ciiva.com/29588/littelfuse-tvs-diode-array-sp4020-datasheet-pdf-29588193.pdf?src-supplier=Digi-Key; ComponentLink1Description: https://datasheet.ciiva.com/29588/littelfuse-tvs-diode-array-sp4020-datasheet-pdf-29588193.pdf?src-supplier=Digi-Key; ComponentLink2URL: https://datasheet.ciiva.com/24111/littelfuse-sp4020-267385-24111169.pdf?src-supplier=Mouser; ComponentLink2Description: https://datasheet.ciiva.com/24111/littelfuse-sp4020-267385-24111169.pdf?src-supplier=Mouser; Supplier 1: Digi-Key; Supplier Part Number 1: 1655-SD03LCCCT-ND; Stock 1: 8808; Pricing 1: 1=0,37000, 10=0,27300, 100=0,15460, 500=0,10240, 1000=0,07851 (USD); RoHS: No; Manufacturer: Sangdest Microelectronics; Manufacturer Part Number 1: SD03LCC
XT2 = CRYSTAL_19M2: Oscillator Crystal 25 MHz; Manufacturer: Abracon; Manufacturer Part Number 1: ABM8-24.000MHZ-D1G-T; Part Description: 24 MHz ±10ppm Crystal 18pF 50 Ohms 4-SMD, No Lead; Value: 24MHz; Supplier 1: Digi-Key; Supplier Part Number 1: 535-14395-1-ND; Stock 1: 15503; Pricing 1: 1=0,47000, 10=0,39100, 50=0,35220, 100=0,31310, 500=0,29744 (USD); RoHS: Yes; RoHS Compliant: Yes; ComponentLink1URL: https://abracon.com/Resonators/abm8.pdf?src-supplier=Digi-Key; ComponentLink1Description: https://abracon.com/Resonators/abm8.pdf?src-supplier=Digi-Key